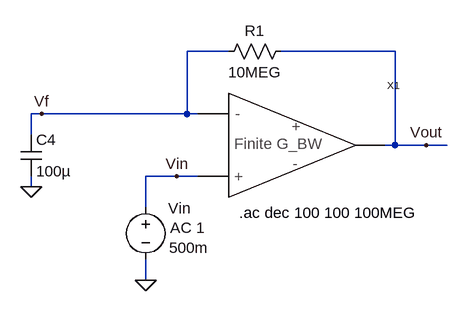
[diagram p0: schematic FiniteGBW_op_amp_AC.asc]
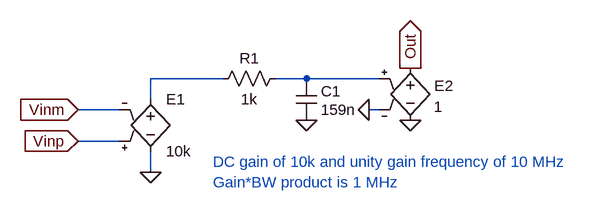
[diagram p1: sub-circuit gain_bw_op_amp.asc]
FiniteGBW_op_amp_AC.asc, the LTspice schematic file:
Version 4
SHEET 1 2760 680
WIRE 1376 -224 1376 -256
WIRE 1376 -144 1376 -160
WIRE 1392 -256 1376 -256
WIRE 1552 -112 1552 -160
WIRE 1552 0 1552 -32
WIRE 1600 -160 1552 -160
WIRE 1616 -256 1392 -256
WIRE 1616 -256 1616 -352
WIRE 1632 -256 1616 -256
WIRE 1632 -160 1600 -160
WIRE 1680 -352 1616 -352
WIRE 1936 -352 1760 -352
WIRE 1936 -208 1920 -208
WIRE 1936 -208 1936 -352
WIRE 1984 -208 1936 -208
WIRE 2016 -208 1984 -208
FLAG 1376 -144 0
FLAG 1392 -256 Vf
FLAG 1984 -208 Vout
FLAG 1552 0 0
FLAG 1600 -160 Vin
SYMBOL cap 1360 -224 R0
SYMATTR InstName C4
SYMATTR Value 100µ
SYMBOL res 1776 -368 R90
WINDOW 0 0 56 VBottom 0
WINDOW 3 32 56 VTop 0
SYMATTR InstName R1
SYMATTR Value 10MEG
SYMBOL Gain_BW_op_amp 1680 -208 R0
SYMATTR InstName X1
SYMBOL voltage 1552 -128 R0
WINDOW 0 35 17 Left 0
WINDOW 3 36 78 Left 0
WINDOW 123 38 47 Left 0
WINDOW 39 0 0 Left 0
SYMATTR InstName Vin
SYMATTR Value 500m
SYMATTR Value2 AC 1
TEXT 1696 -104 Left 0 !.ac dec 100 100 100MEG

gain_bw_op_amp.asc, the sub-circuit schematic file:
Version 4
SHEET 1 6300 692
WIRE 1424 288 1360 288
WIRE 1424 336 1360 336
WIRE 1472 272 1472 240
WIRE 1472 384 1472 352
WIRE 1584 240 1472 240
WIRE 1712 240 1664 240
WIRE 1824 240 1712 240
WIRE 1824 288 1808 288
FLAG 1472 384 0
FLAG 1360 288 Vinm
IOPIN 1360 288 In
FLAG 1360 336 Vinp
IOPIN 1360 336 In
FLAG 1872 224 Out
IOPIN 1872 224 Out
FLAG 1712 304 0
FLAG 1808 288 0
FLAG 1872 304 0
SYMBOL e2 1472 256 R0
SYMATTR InstName E1
SYMATTR Value 10k
SYMBOL res 1680 224 R90
WINDOW 0 0 56 VBottom 0
WINDOW 3 32 56 VTop 0
SYMATTR InstName R1
SYMATTR Value 1k
SYMBOL cap 1696 240 R0
WINDOW 0 38 19 Left 0
WINDOW 3 38 48 Left 0
SYMATTR InstName C1
SYMATTR Value 159n
SYMBOL e 1872 208 R0
WINDOW 0 37 43 Left 0
WINDOW 3 36 75 Left 0
SYMATTR InstName E2
SYMATTR Value 1
TEXT 1568 368 Left 0 ;DC gain of 10k and unity gain frequency of 10 MHz\nGain*BW product is 1 MHz

The netlist it stands for:
* FiniteGBW_op_amp_AC.asc
C4 Vf 0 100µ
R1 Vout Vf 10MEG
XX1 Vf Vin Vout gain_bw_op_amp
Vin Vin 0 500m AC 1

* block symbol definitions
.subckt gain_bw_op_amp Vinm Vinp Out
E1 N001 0 Vinp Vinm 10k
R1 N002 N001 1k
C1 N002 0 159n
E2 Out 0 N002 0 1
* DC gain of 10k and unity gain frequency of 10 MHz
* Gain*BW product is 1 MHz
.ends gain_bw_op_amp

.ac dec 100 100 100MEG
.backanno
.end